# Altium schematic sheet MCU.SchDoc
size B; SheetNumber: 2; SheetTotal: 6
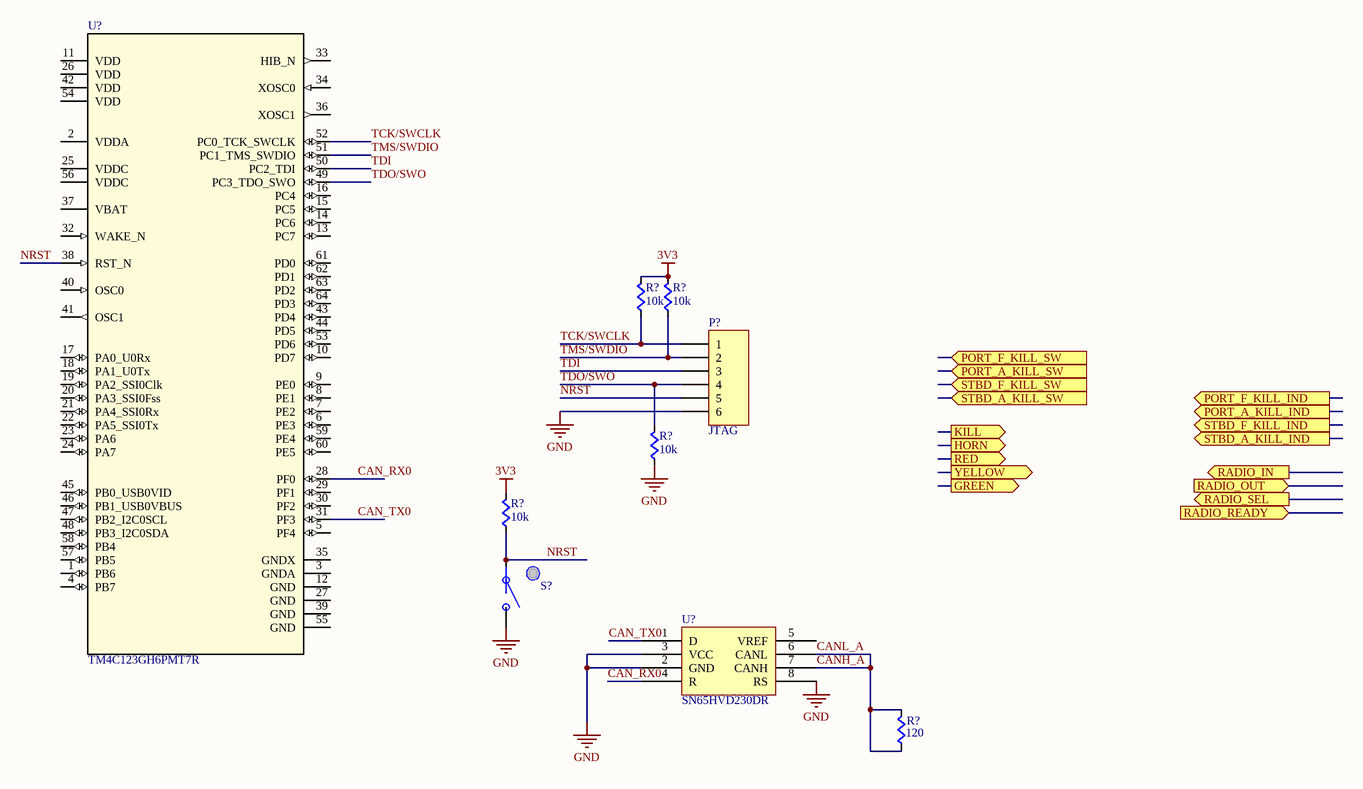
[diagram p0: MCU.SchDoc]

## Parts
(Parts that share a designator on the sheet are numbered #1, #2 ... from top to bottom, then left to right.)
P?  JTAG  [HDR1X6]
R?#1  value 10k  [RES0603]  (hidden comment: Res)
R?#2  value 10k  [RES0603]  (hidden comment: Res)
R?#3  value 10k  [RES0603]  (hidden comment: Res)
R?#4  value 10k  [RES0603]  (hidden comment: Res)
R?#5  value 120  [RES0603]  (hidden comment: Res)
S?  Button  [PTS645xxxxSMTR92]  (value not drawn)
U?#1  TM4C123GH6PMT7R  [PM0064A_N]
U?#2  SN65HVD230DR  [SOIC-8pin]

## Ports
GREEN (out), HORN (out), KILL (out), PORT_A_KILL_IND (out), PORT_A_KILL_SW (in), PORT_F_KILL_IND (out), PORT_F_KILL_SW (in), RADIO_IN (out), RADIO_OUT (in), RADIO_READY (in), RADIO_SEL (out), RED (out), STBD_A_KILL_IND (out), STBD_A_KILL_SW (in), STBD_F_KILL_IND (out), STBD_F_KILL_SW (in), YELLOW (out)

## Nets
3V3: R?#1.1(A) R?#2.1(A) R?#4.1(A)
GND: P?.6 R?#3.2(B) S?.B U?#2.2(GND) U?#2.3(VCC) U?#2.8(RS)
CAN_RX0: U?#1.28(PF0) U?#2.4(R)
CAN_TX0: U?#1.31(PF3) U?#2.1(D)
CANH_A: R?#5.1(A) R?#5.2(B) U?#2.6(CANL) U?#2.7(CANH)  [also labelled CANL_A]
NRST: P?.5 R?#4.2(B) S?.A U?#1.38(RST_N)
TCK/SWCLK: P?.1 R?#1.2(B) U?#1.52(PC0_TCK_SWCLK)
TDI: P?.3 U?#1.50(PC2_TDI)
TDO/SWO: P?.4 R?#3.1(A) U?#1.49(PC3_TDO_SWO)
TMS/SWDIO: P?.2 R?#2.2(B) U?#1.51(PC1_TMS_SWDIO)

Not connected (* = marked no-connect by the designer): U?#1 1(PB6) 2(VDDA) 3(GNDA) 4(PB7) 5(PF4) 6(PE3) 7(PE2) 8(PE1) 9(PE0) 10(PD7) 11(VDD) 12(GND) 13(PC7) 14(PC6) 15(PC5) 16(PC4) 17(PA0_U0Rx) 18(PA1_U0Tx) 19(PA2_SSI0Clk) 20(PA3_SSI0Fss) 21(PA4_SSI0Rx) 22(PA5_SSI0Tx) 23(PA6) 24(PA7) 25(VDDC) 26(VDD) 27(GND) 29(PF1) 30(PF2) 32(WAKE_N) 33(HIB_N) 34(XOSC0) 35(GNDX) 36(XOSC1) 37(VBAT) 39(GND) 40(OSC0) 41(OSC1) 42(VDD) 43(PD4) 44(PD5) 45(PB0_USB0VID) 46(PB1_USB0VBUS) 47(PB2_I2C0SCL) 48(PB3_I2C0SDA) 53(PD6) 54(VDD) 55(GND) 56(VDDC) 57(PB5) 58(PB4) 59(PE4) 60(PE5) 61(PD0) 62(PD1) 63(PD2) 64(PD3); U?#2 5(VREF)

## Library data of the parts
P? = Header 6: Header, 6-Pin; LatestRevisionDate: 17-Jul-2002; LatestRevisionNote: Re-released for DXP Platform.; Publisher: Altium Limited
S? = Button: SPST Button; Supplier 1: Digi-Key; Supplier Part Number 1: CKN9087CT-ND
U?#1 = TM4C123GH6PMT7R: Imported; PartNumber: TM4C123GH6PMTR; Manufacturer: Texas Instruments; CompType: IC; PIN_COUNT: 64; Application_BuildNumber: *; Alternate_PartNumber: TM4C123GH6PMT; PackageReference: PM0064A; MountType: SMT; RoHS: Y; RefDes: RefDes; TYPE: TYPE; Value: Value
U?#2 = SN65HVD230DR: IC TXRX CAN 1MBPS 3.3V 8SOIC; Supplier 1: Digi-Key; Supplier Part Numbe 1: 296-11654-1-ND
R?#1-R?#5 = Res: Supplier 1: Digi-Key; Supplier Part Number 1: RMCF0603JT10K0CT-ND